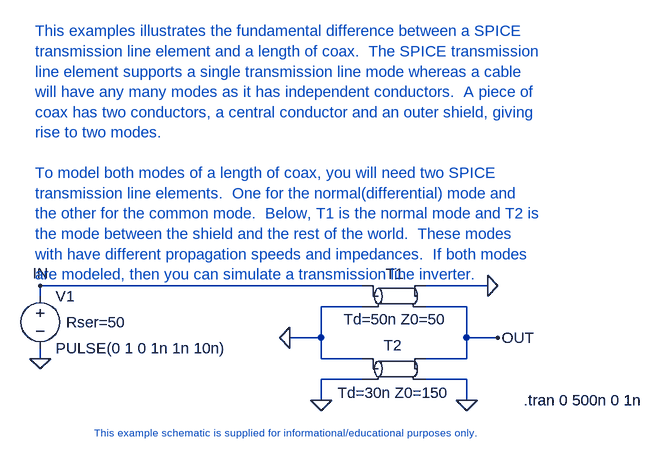
[diagram p0: schematic TransmissionLineInverter.asc]
TransmissionLineInverter.asc, the LTspice schematic file:
Version 4
SHEET 1 1272 680
WIRE 128 192 -368 192
WIRE 320 192 224 192
WIRE -368 208 -368 192
WIRE 128 224 64 224
WIRE 288 224 224 224
WIRE 64 272 64 224
WIRE 64 272 16 272
WIRE 288 272 288 224
WIRE 336 272 288 272
WIRE -368 304 -368 288
WIRE 64 304 64 272
WIRE 128 304 64 304
WIRE 288 304 288 272
WIRE 288 304 224 304
WIRE 128 336 64 336
WIRE 288 336 224 336
WIRE 64 368 64 336
WIRE 288 368 288 336
FLAG 64 368 0
FLAG 288 368 0
FLAG -368 304 0
FLAG 16 272 0
FLAG 320 192 0
FLAG -368 192 IN
FLAG 336 272 OUT
SYMBOL tline 176 208 R0
WINDOW 0 2 -19 Bottom 2
WINDOW 3 3 20 Top 2
SYMATTR InstName T1
SYMBOL tline 176 320 R0
WINDOW 0 -1 -21 Bottom 2
WINDOW 3 0 21 Top 2
SYMATTR InstName T2
SYMATTR Value Td=30n Z0=150
SYMBOL voltage -368 192 R0
WINDOW 123 0 0 Left 2
WINDOW 39 40 56 Left 2
SYMATTR SpiceLine Rser=50
SYMATTR InstName V1
SYMATTR Value PULSE(0 1 0 1n 1n 10n)
TEXT 376 368 Left 2 !.tran 0 500n 0 1n
TEXT 0 408 Top 1 ;This example schematic is supplied for informational/educational purposes only.
TEXT -376 -200 Left 2 ;This examples illustrates the fundamental difference between a SPICE\ntransmission line element and a length of coax.  The SPICE transmission\nline element supports a single transmission line mode whereas a cable\nwill have any many modes as it has independent conductors.  A piece of\ncoax has two conductors, a central conductor and an outer shield, giving\nrise to two modes.\n \nTo model both modes of a length of coax, you will need two SPICE\ntransmission line elements.  One for the normal(differential) mode and\nthe other for the common mode.  Below, T1 is the normal mode and T2 is\nthe mode between the shield and the rest of the world.  These modes\nwith have different propagation speeds and impedances.  If both modes\nare modeled, then you can simulate a transmission line inverter.

The netlist it stands for:
* TransmissionLineInverter.asc
T1 IN 0 0 OUT Td=50n Z0=50
T2 0 0 OUT 0 Td=30n Z0=150
V1 IN 0 PULSE(0 1 0 1n 1n 10n) Rser=50
.tran 0 500n 0 1n
* This example schematic is supplied for informational/educational purposes only.
* This examples illustrates the fundamental difference between a SPICE
* transmission line element and a length of coax.  The SPICE transmission
* line element supports a single transmission line mode whereas a cable
* will have any many modes as it has independent conductors.  A piece of
* coax has two conductors, a central conductor and an outer shield, giving
* rise to two modes.
* To model both modes of a length of coax, you will need two SPICE
* transmission line elements.  One for the normal(differential) mode and
* the other for the common mode.  Below, T1 is the normal mode and T2 is
* the mode between the shield and the rest of the world.  These modes
* with have different propagation speeds and impedances.  If both modes
* are modeled, then you can simulate a transmission line inverter.
.backanno
.end